# EAGLE design htx212_rpi (EAGLE 7.1.0)
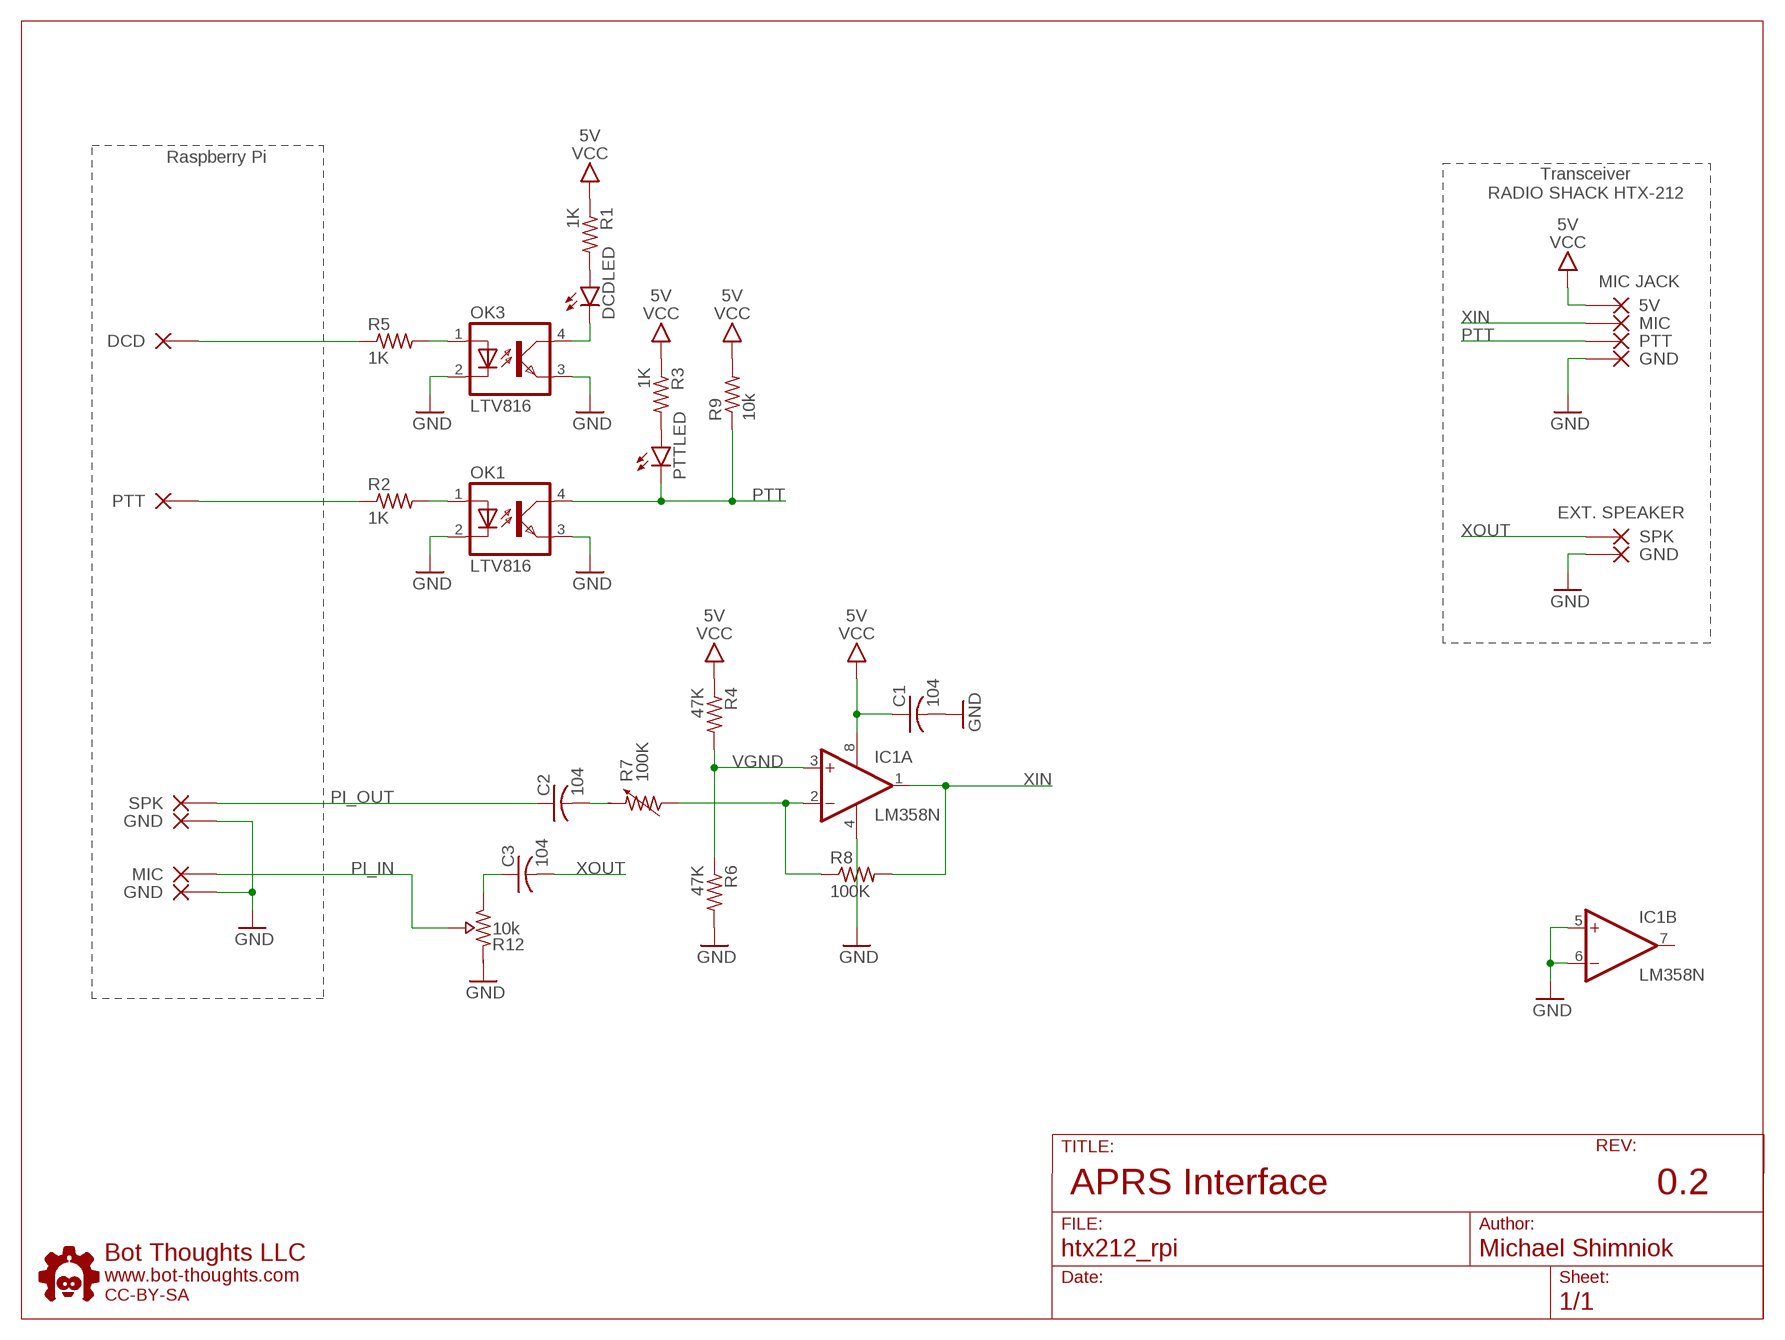
[diagram p0: schematic, sheet 1]

## Parts
C1  104  C-075PTH  [C075]
C2  104  C-075PTH  [C075]
C3  104  C-050PTH  [C050]
DCDLED  LED5MMRA  [LED5MMRA]
IC1  LM358N  [DIL08]
OK1  LTV816  [DIL04]
OK3  LTV816  [DIL04]
PTTLED  LED5MMRA  [LED5MMRA]
R1  1K  R0204/7-PTH  [0204/7]
R2  1K  R0204/7-PTH  [0204/7]
R3  1K  R0204/7-PTH  [0204/7]
R4  47K  R0204/7-PTH  [0204/7]
R5  1K  R0204/7-PTH  [0204/7]
R6  47K  R0204/7-PTH  [0204/7]
R7  100K  TRIM_2-CA6V  [CA6V]
R8  100K  R0204/7-PTH  [0204/7]
R9  10k  R0204/7-PTH  [0204/7]
R12  10k  TRIM-CA6V  [CA6V]
U$3  BTLOGO-LOGO-MD  [BTLOGOM]
X1  MIC  WIREPAD_22GA  [PAD_22GA]
X2  GND  WIREPAD_22GA  [PAD_22GA]
X3  PTT  WIREPAD_22GA  [PAD_22GA]
X4  5V  WIREPAD_22GA  [PAD_22GA]
X5  GND  WIREPAD_22GA  [PAD_22GA]
X6  SPK  WIREPAD_22GA  [PAD_22GA]
X7  MIC  WIREPAD_22GA  [PAD_22GA]
X8  GND  WIREPAD_22GA  [PAD_22GA]
X9  PTT  WIREPAD_24GA  [PAD_24GA]
X12  SPK  WIREPAD_22GA  [PAD_22GA]
X13  GND  WIREPAD_22GA  [PAD_22GA]
X15  DCD  WIREPAD_24GA  [PAD_24GA]

## Nets
DCD_CTL: R5.1 X15.P$1(P)
GND: C1.2(-) IC1.4(P:V-) IC1.5(B:+IN) IC1.6(B:-IN) OK1.2(C) OK1.3(EMIT) OK3.2(C) OK3.3(EMIT) R6.2 R12.E(B) X2.P$1(P) X5.P$1(P) X8.P$1(P) X13.P$1(P)
N$1: OK1.1(A) R2.2
N$2: DCDLED.A R1.2
N$3: DCDLED.C OK3.4(COL)
N$4: PTTLED.A R3.2
N$5: OK3.1(A) R5.2
N$6: C3.1(+) R12.A
N$7: IC1.2(A:-IN) R7.S(WIPER) R8.1
N$8: C2.2(-) R7.E(B)
PI_IN: R12.S(WIPER) X7.P$1(P)
PI_OUT: C2.1(+) X6.P$1(P)
PTT: OK1.4(COL) PTTLED.C R9.1 X3.P$1(P)
PTT_CTL: R2.1 X9.P$1(P)
VCC: C1.1(+) IC1.8(P:V+) R1.1 R3.1 R4.1 R9.2 X4.P$1(P) ; supply symbol labelled 5V
VGND: IC1.3(A:+IN) R4.2 R6.1
XIN: IC1.1(A:OUT) R8.2 X1.P$1(P)
XOUT: C3.2(-) X12.P$1(P)
Unconnected: IC1.7(B:OUT)

## Notes on the sheet
- Raspberry Pi
- Transceiver
  RADIO SHACK HTX-212
- MIC JACK
- EXT. SPEAKER
- APRS Interface | 0.2

## Library data of the parts
C1-C3 = bt_rcl:C: Capacitor, non-polarized, American symbol
DCDLED PTTLED = bt_opto:LED: LED Various packages
IC1 = linear:LM358: OP AMP also LM158; LM258; LM2904 Source: http://cache.national.com/ds/LM/LM158.pdf
OK1 OK3 = optocoupler:LTV816: OPTO COUPLER Source: LITEON, LTV816.pdf; OC_FARNELL: unknown; OC_NEWARK: unknown
R1-R6 R8 R9 = bt_rcl:R: Resistor, American symbol
R7 = bt_electromech:TRIM_2-: POTENTIOMETER
R12 = bt_electromech:TRIM-: POTENTIOMETER
U$3 = bt:BTLOGO: Bot Thoughts Logo
X1-X9 X12 X13 X15 = bt_electromech:WIREPAD: PIN PAD Generic pin pad / wire pad / wirepad connector

## Board
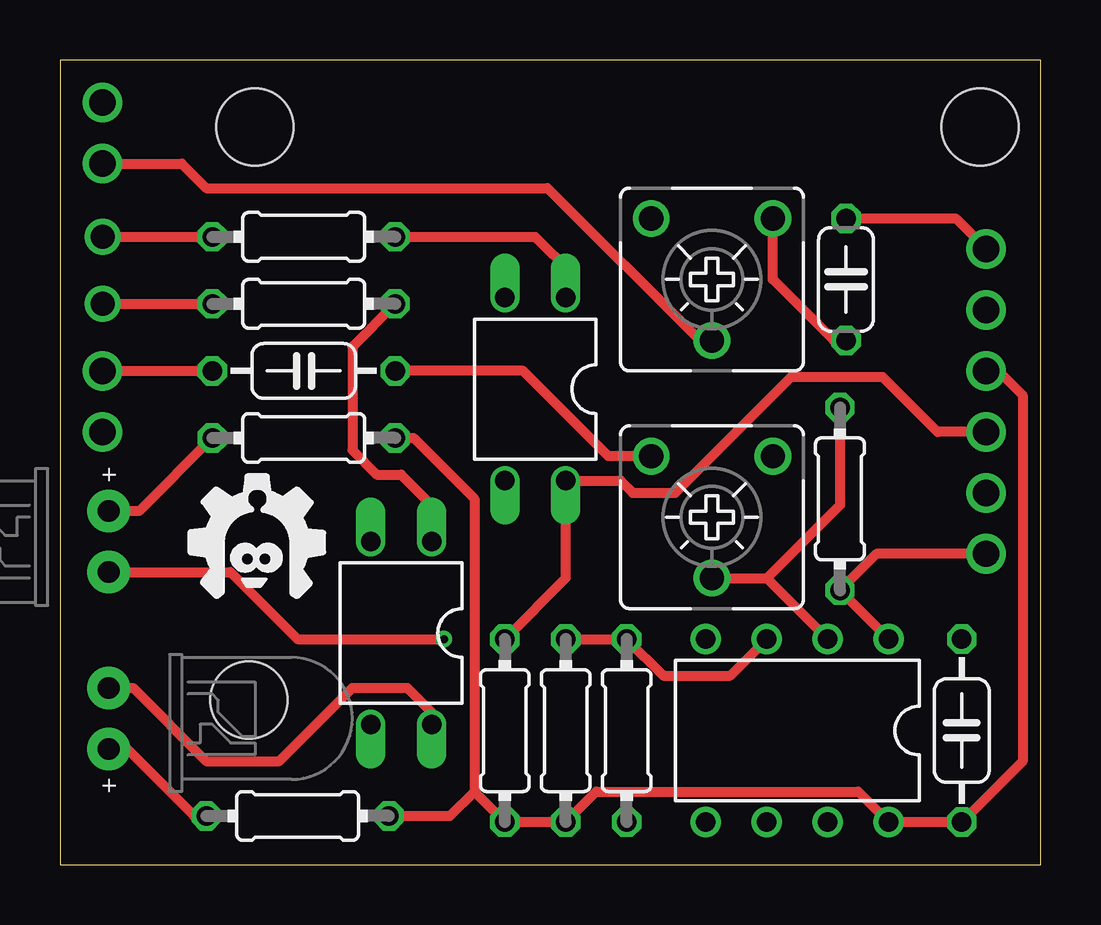
[diagram p1: board, top side]
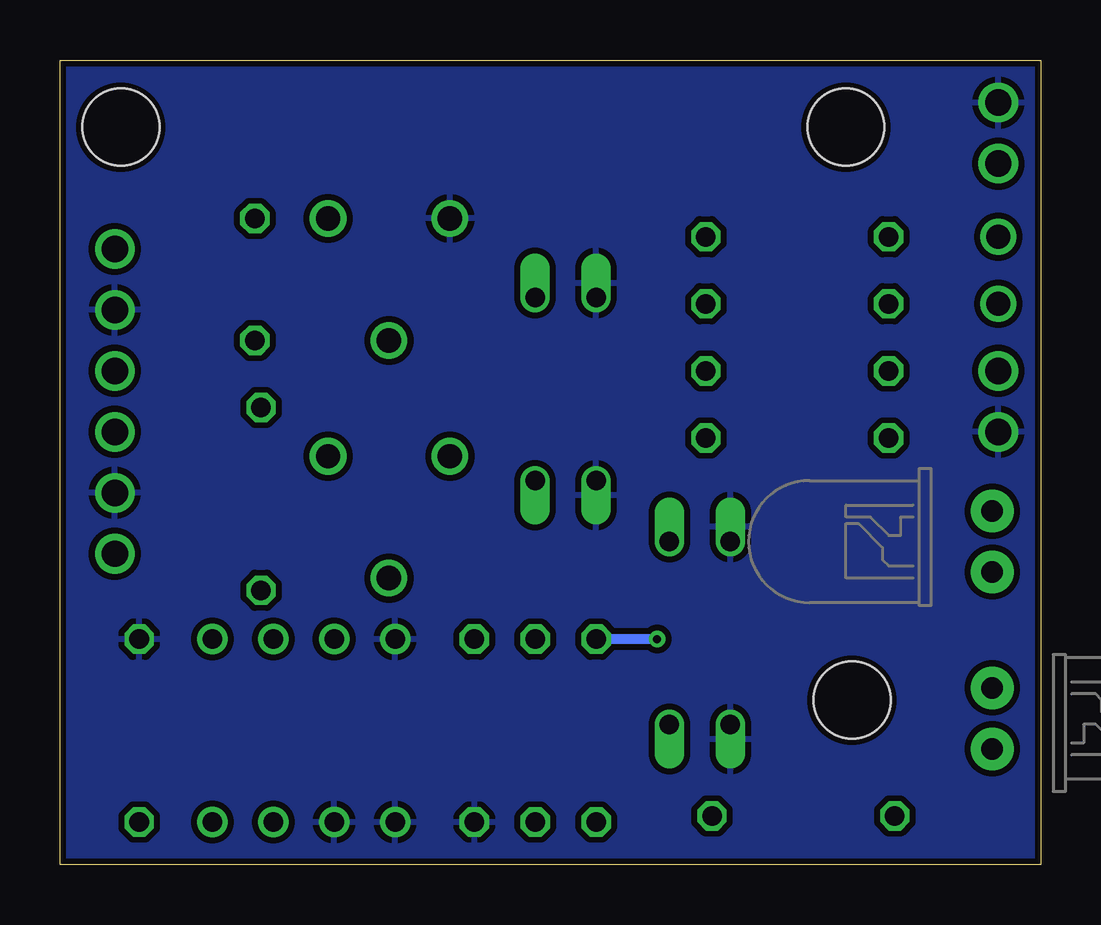
[diagram p2: board, bottom side, seen from below]

Size 40.89 x 33.53 mm. Coordinates in mm from the lower left corner, seen from the top.
Outline: 40.89,33.53 0,33.53 0,0 40.89,0 40.89,33.53
Copper layers (1*16): Top 0.0356mm / dielectric 1.5011mm / Bottom 0.0356mm
Design rules "LaenPCBOrder": minimum track width 6mil, minimum drill 13mil, track to track 10mil, track to pad 10mil, pad to pad 10mil, via to via 10mil, smd to smd 8mil, copper to edge 10mil, drill to drill 10mil, minimum pad ring 7mil, minimum via ring 7mil, stop-mask expansion 3mil, vias tented up to drill 20mil, thermal gap 10mil
Holes 3.2 mm at 38.35,30.73 7.87,6.86 8.13,30.73

### Footprints (pad centres in the part's own frame; a part is rotated, then mirrored left to right if it is on the bottom)
C075 = drill 0.813 octagon: 1 -3.81,0; 2 3.81,0
C050 = drill 0.813 octagon: 1 -2.54,0; 2 2.54,0
LED5MMRA = drill 0.9 pad 1.778: A 0,1.27; C 0,-1.27
DIL08 = drill 0.813 pad 1.27: 1 -3.81,-3.81; 2 -1.27,-3.81; 3 1.27,-3.81; 4 3.81,-3.81; 5 3.81,3.81; 6 1.27,3.81; 7 -1.27,3.81; 8 -3.81,3.81
DIL04 = drill 0.813 offset: 1 -1.27,-3.81; 2 1.27,-3.81; 3 1.27,3.81; 4 -1.27,3.81
0204/7 = drill 0.813 octagon: 1 -3.81,0; 2 3.81,0
CA6V = drill 1.016: A -2.54,-2.54; E 2.54,-2.54; S 0,2.54
PAD_22GA = drill 1.1: P$1 0,0
PAD_24GA = drill 1: P$1 0,0

### Placement (x,y rotation side)
C1  37.59,5.59 90 top
C2  10.16,20.57 0 top
C3  32.77,24.38 90 top
DCDLED  2.03,6.1 180 top
IC1  30.73,5.59 180 top
OK1  19.81,19.81 180 top
OK3  14.22,9.65 180 top
PTTLED  2.03,13.46 0 top
R1  9.91,2.03 180 top
R2  10.16,26.16 0 top
R3  10.16,17.78 180 top
R4  21.08,5.59 90 top
R5  10.16,23.37 0 top
R6  23.62,5.59 270 top
R7  27.18,14.48 180 top
R8  32.51,15.24 270 top
R9  18.54,5.59 270 top
R12  27.18,24.38 180 top
U$3  8.13,10.92 0 top
X1  38.61,12.95 180 top
X2  1.78,18.03 0 top
X3  38.61,18.03 180 top
X4  38.61,20.57 180 top
X5  38.61,15.49 180 top
X6  1.78,20.57 0 top
X7  1.78,29.21 0 top
X8  1.78,31.75 0 top
X9  1.78,26.16 0 top
X12  38.61,25.65 180 top
X13  38.61,23.11 180 top
X15  1.78,23.37 0 top

### Tracks (layer width: path | path; a pad name or v marks a point on that pad's centre or on a via)
DCD_CTL
  Top 0.406: X15.P$1 R5.1
GND
  pour Bottom: 0,0 0,33.53 40.89,33.53 40.89,0
N$1
  Top 0.406: R2.2 19.81,26.16 21.34,24.64 OK1.1
N$2
  Top 0.406: R1.2 5.59,2.03 2.79,4.83 DCDLED.A
N$3
  Top 0.406: DCDLED.C 3.05,7.37 6.1,4.32 9.14,4.32 12.19,7.37 14.48,7.37 15.49,6.35 OK3.4
N$4
  Top 0.406: R3.2 3.3,14.73 PTTLED.A
N$5
  Top 0.406: R5.2 12.19,21.59 12.19,17.27 13.21,16.26 14.22,16.26 15.49,14.99 OK3.1
N$6
  Top 0.406: C3.1 32.26,21.84 29.72,24.38 R12.A
N$7
  Top 0.406: R7.S 29.46,11.94 | 29.46,11.94 IC1.2 | R8.1 32.51,14.99 29.46,11.94
N$8
  Top 0.406: R7.E 22.86,17.02 19.3,20.57 C2.2
PI_IN
  Top 0.406: X7.P$1 5.08,29.21 6.1,28.19 20.32,28.19 26.67,21.84 R12.S
PI_OUT
  Top 0.406: X6.P$1 C2.1
PTT  (via drill 0.33)
  Top 0.406: PTTLED.C 7.11,12.19 9.91,9.4 v16,9.4 | R9.1 21.08,11.94 OK1.4 23.37,16 23.88,15.49 25.65,15.49 30.48,20.32 34.29,20.32 36.58,18.03 X3.P$1
  Bottom 0.406: v16,9.4 R9.1
PTT_CTL
  Top 0.406: X9.P$1 R2.1
VCC
  Top 0.406: R1.1 16.26,2.03 17.27,3.05 | R3.1 14.73,17.78 17.27,15.24 17.27,3.05 | X4.P$1 39.12,20.57 40.13,19.56 40.13,4.32 C1.1 IC1.8 33.27,3.05 22.35,3.05 R4.1 R9.2 17.27,3.05
VGND
  Top 0.406: R4.2 R6.1 25.15,7.87 27.94,7.87 IC1.3
XIN
  Top 0.406: IC1.1 R8.2 34.04,12.95 X1.P$1
XOUT
  Top 0.406: C3.2 37.34,26.92 X12.P$1

### Text on the board
tValues: R0.2 | APRS I/F | www.bot-thoughts.com | XCVR | SPK | PTTLED | MIC | cc-by-sa | DCDLED | RPi